# EAGLE design Xadow - GSM Breakout v1.0 (EAGLE 6.4)
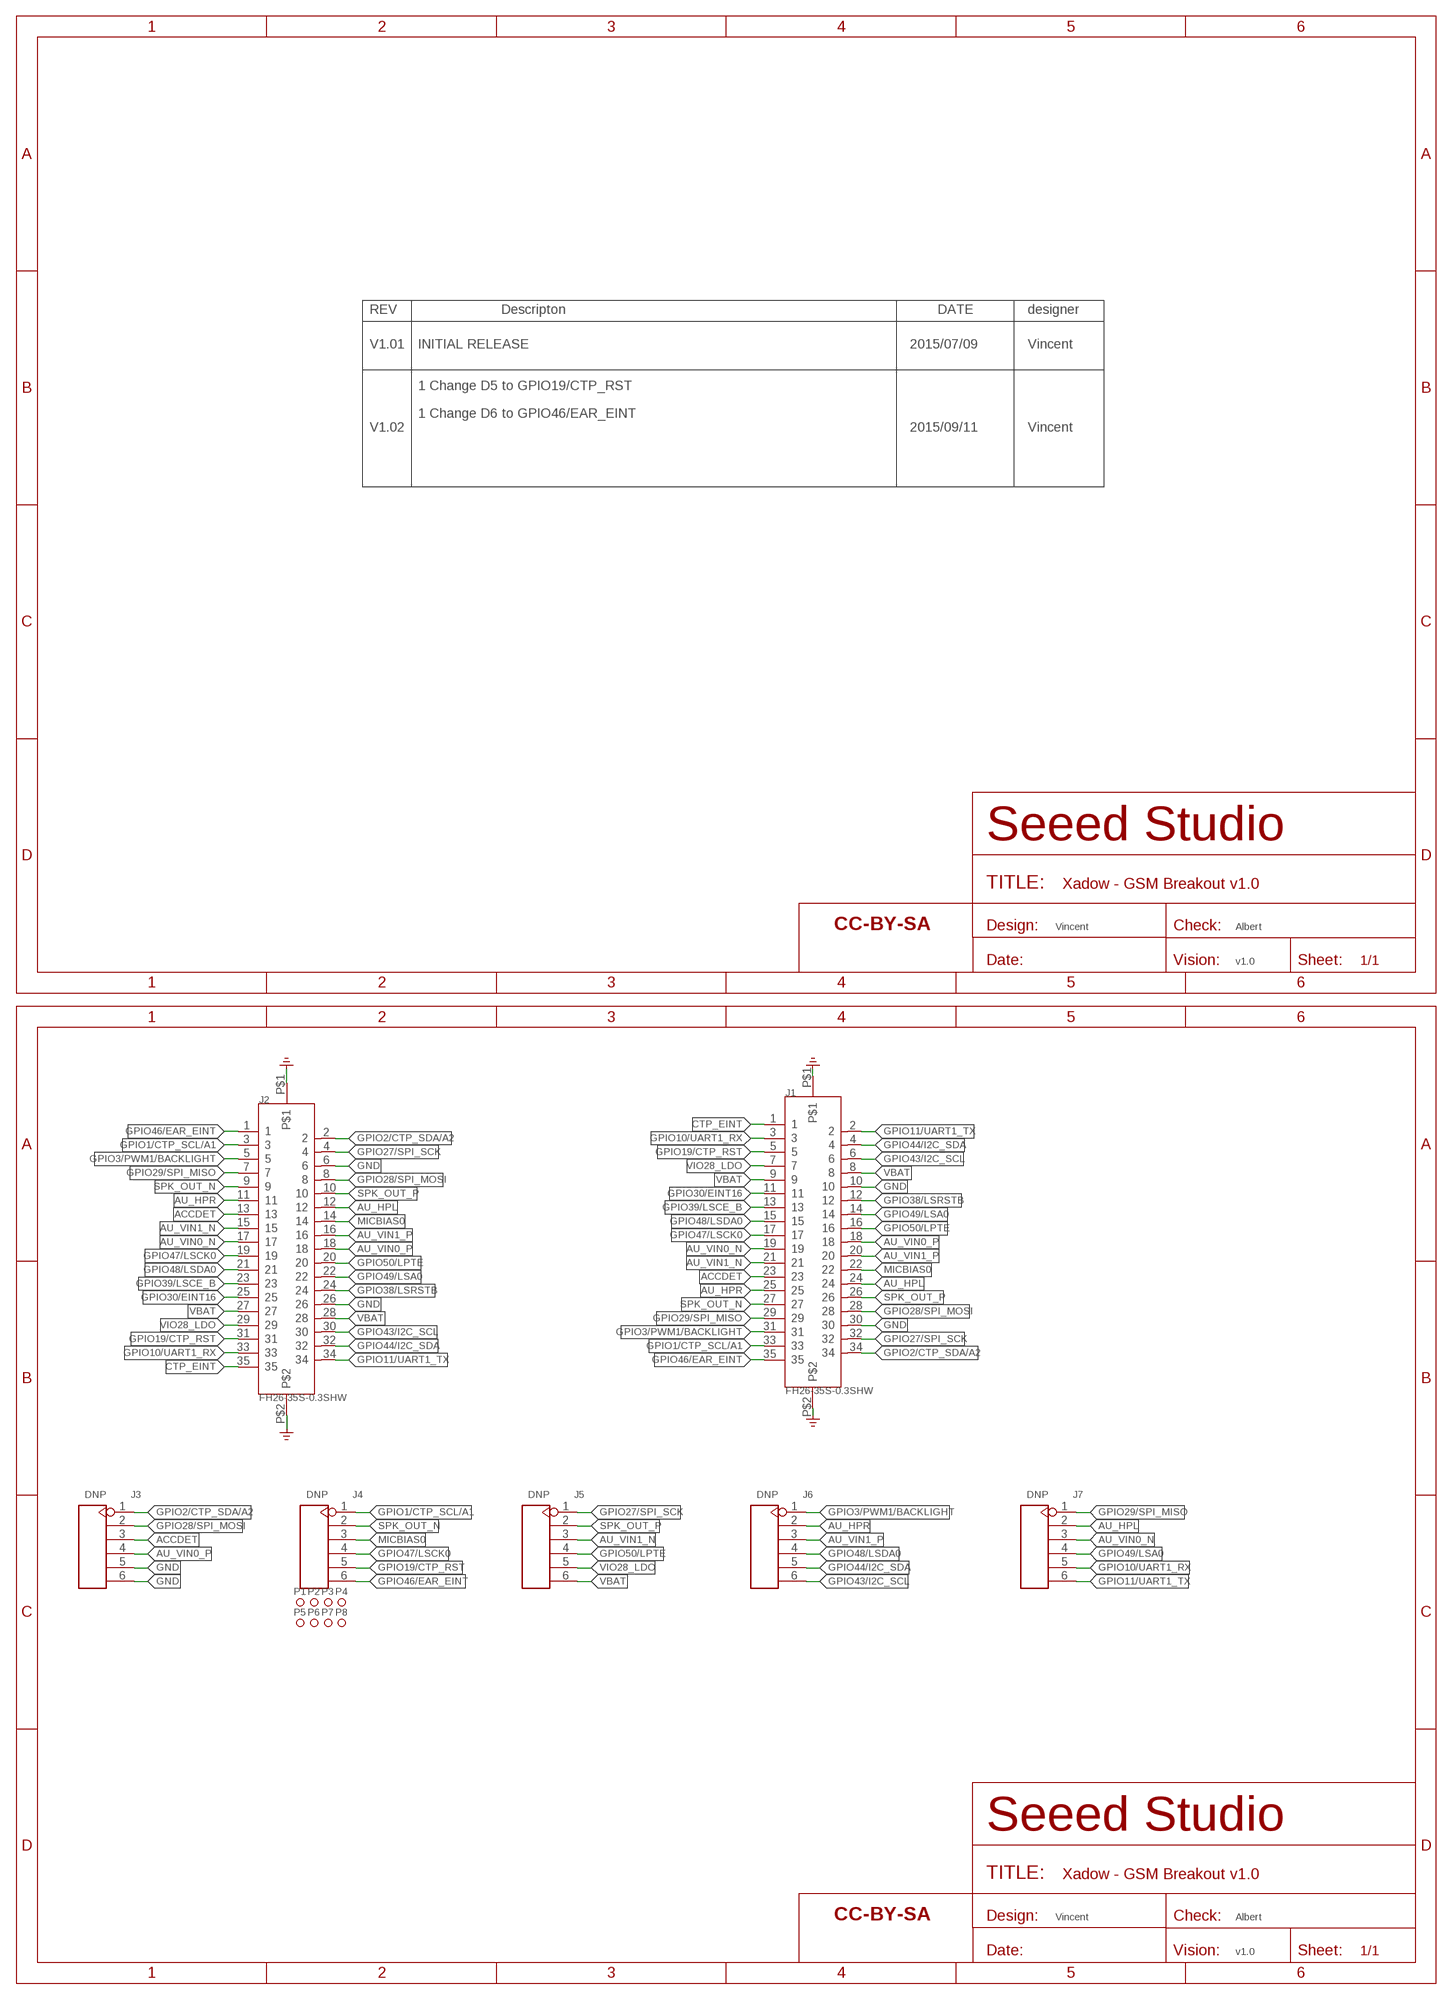
[diagram p0: schematic, sheet 1]

## Parts
FR1  SEEEDSTUDIO-OPEN-SCH-FRAME  [SEEEDSTUDIO-PCB-FRAME]
FR2  SEEEDSTUDIO-OPEN-SCH-FRAME  [SEEEDSTUDIO-PCB-FRAME]
J1  FH26-35S-0.3SHW  FPC-CONNECTER-35P(FH26W-35S-0.3SHW(10))  [FPC35-SMD-0.3(FH26W)]
J2  FH26-35S-0.3SHW  FPC-CONNECTER-35P(FH26W-35S-0.3SHW(10))  [FPC35-SMD-0.3(FH26W)]
J3  DNP  HEADER-6P-65/35MIL  [H6-2.54-C65D35MIL]
J4  DNP  HEADER-6P-65/35MIL  [H6-2.54-C65D35MIL]
J5  DNP  HEADER-6P-65/35MIL  [H6-2.54-C65D35MIL]
J6  DNP  HEADER-6P-65/35MIL  [H6-2.54-C65D35MIL]
J7  DNP  HEADER-6P-65/35MIL  [H6-2.54-C65D35MIL]
P1  MARK-1.0'ANNULAR'  [ROUND-MARK-1.0]
P2  MARK-1.0'ANNULAR'  [ROUND-MARK-1.0]
P3  MARK-1.0'ANNULAR'  [ROUND-MARK-1.0]
P4  MARK-1.0'ANNULAR'  [ROUND-MARK-1.0]
P5  MARK-1.0'ANNULAR'  [ROUND-MARK-1.0]
P6  MARK-1.0'ANNULAR'  [ROUND-MARK-1.0]
P7  MARK-1.0'ANNULAR'  [ROUND-MARK-1.0]
P8  MARK-1.0'ANNULAR'  [ROUND-MARK-1.0]

## Nets
ACCDET: J1.23 J2.13 J3.3
AU_HPL: J1.24 J2.12 J7.2
AU_HPR: J1.25 J2.11 J6.2
AU_VIN0_N: J1.19 J2.17 J7.3
AU_VIN0_P: J1.18 J2.18 J3.4
AU_VIN1_N: J1.21 J2.15 J5.3
AU_VIN1_P: J1.20 J2.16 J6.3
CTP_EINT: J1.1 J2.35
GND: J1.10 J1.30 J1.P$1 J1.P$2 J2.6 J2.26 J2.P$1 J2.P$2 J3.5 J3.6 ; supply symbol labelled GND_POWER
GPIO1/CTP_SCL/A1: J1.33 J2.3 J4.1
GPIO2/CTP_SDA/A2: J1.34 J2.2 J3.1
GPIO3/PWM1/BACKLIGHT: J1.31 J2.5 J6.1
GPIO10/UART1_RX: J1.3 J2.33 J7.5
GPIO11/UART1_TX: J1.2 J2.34 J7.6
GPIO19/CTP_RST: J1.5 J2.31 J4.5
GPIO27/SPI_SCK: J1.32 J2.4 J5.1
GPIO28/SPI_MOSI: J1.28 J2.8 J3.2
GPIO29/SPI_MISO: J1.29 J2.7 J7.1
GPIO30/EINT16: J1.11 J2.25
GPIO38/LSRSTB: J1.12 J2.24
GPIO39/LSCE_B: J1.13 J2.23
GPIO43/I2C_SCL: J1.6 J2.30 J6.6
GPIO44/I2C_SDA: J1.4 J2.32 J6.5
GPIO46/EAR_EINT: J1.35 J2.1 J4.6
GPIO47/LSCK0: J1.17 J2.19 J4.4
GPIO48/LSDA0: J1.15 J2.21 J6.4
GPIO49/LSA0: J1.14 J2.22 J7.4
GPIO50/LPTE: J1.16 J2.20 J5.4
MICBIAS0: J1.22 J2.14 J4.3
SPK_OUT_N: J1.27 J2.9 J4.2
SPK_OUT_P: J1.26 J2.10 J5.2
VBAT: J1.8 J1.9 J2.27 J2.28 J5.6
VIO28_LDO: J1.7 J2.29 J5.5

## Notes on the sheet
- REV | Descripton | DATE | designer
- V1.01 | INITIAL RELEASE | 2015/07/09 | Vincent
- 1 Change D5 to GPIO19/CTP_RST
- 1 Change D6 to GPIO46/EAR_EINT
- V1.02 | 2015/09/11 | Vincent
- Vincent | Albert
- v1.0
- Vincent | Albert
- v1.0

## Library data of the parts
FR1 FR2 = moudle-new:SEEEDSTUDIO-OPEN-SCH-FRAME
J1 J2 = template:FPC-CONNECTER-35P(FH26W-35S-0.3SHW(10))
J3-J7 = Connector-new:HEADER-6P
P1-P8 = Discrete-new:MARK-1.0; PARTNO: DNP

## Board
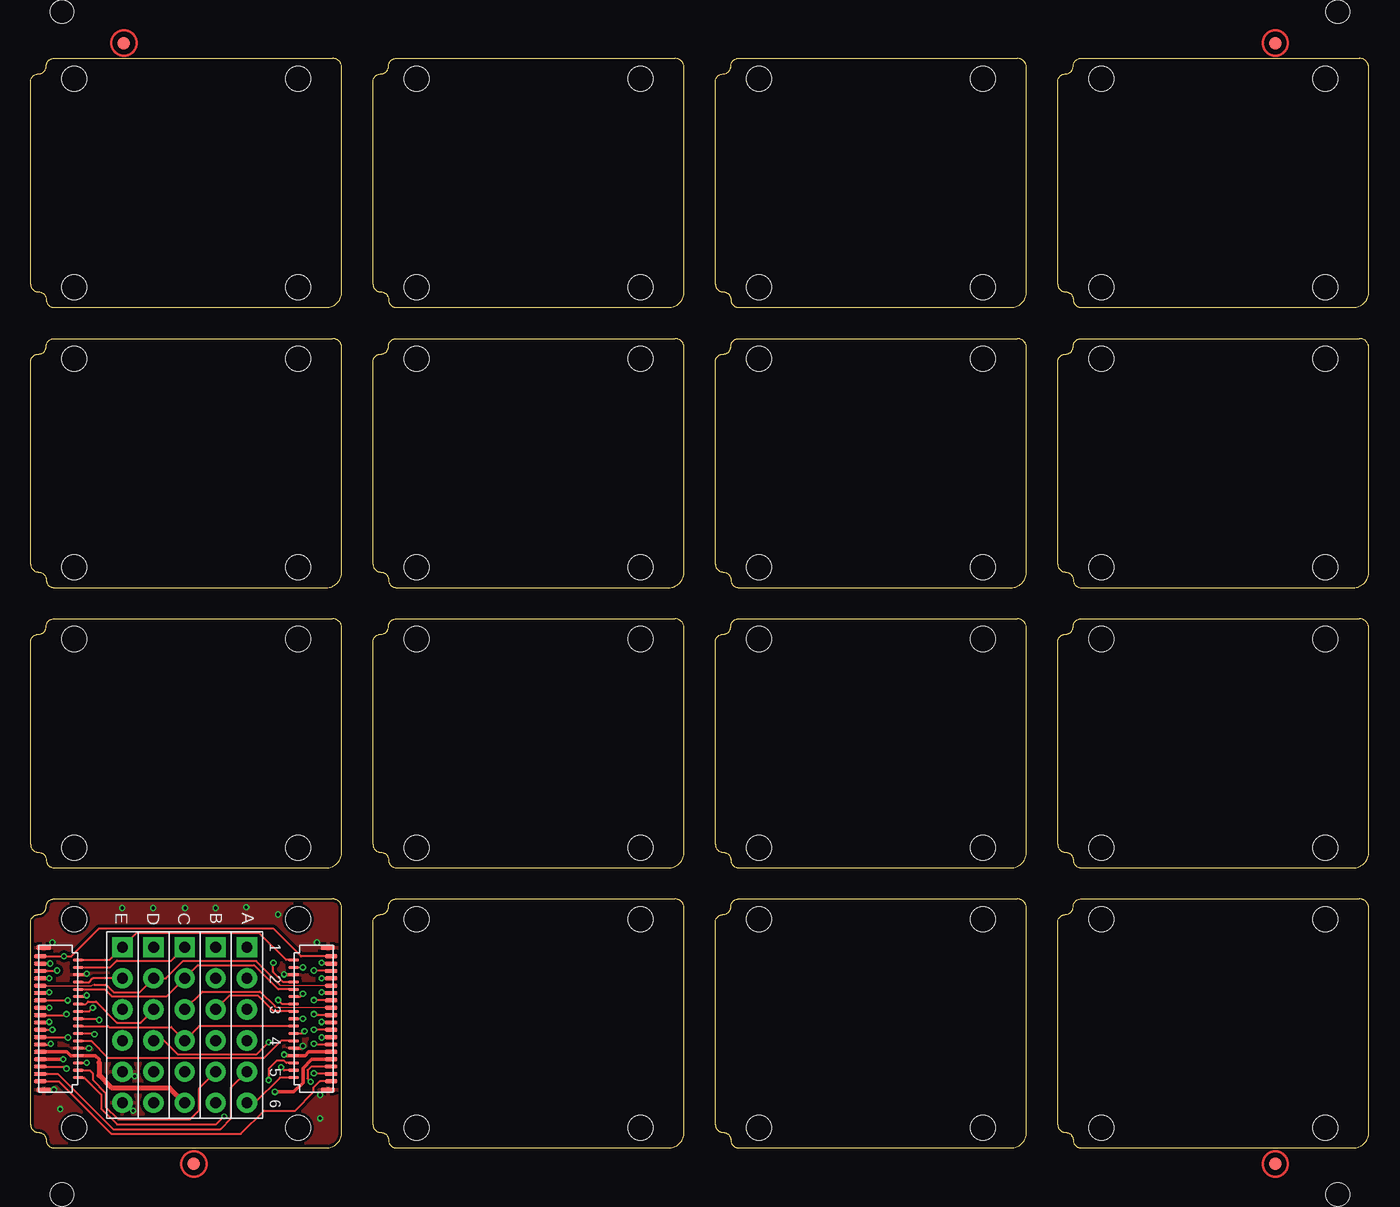
[diagram p1: board, top side]
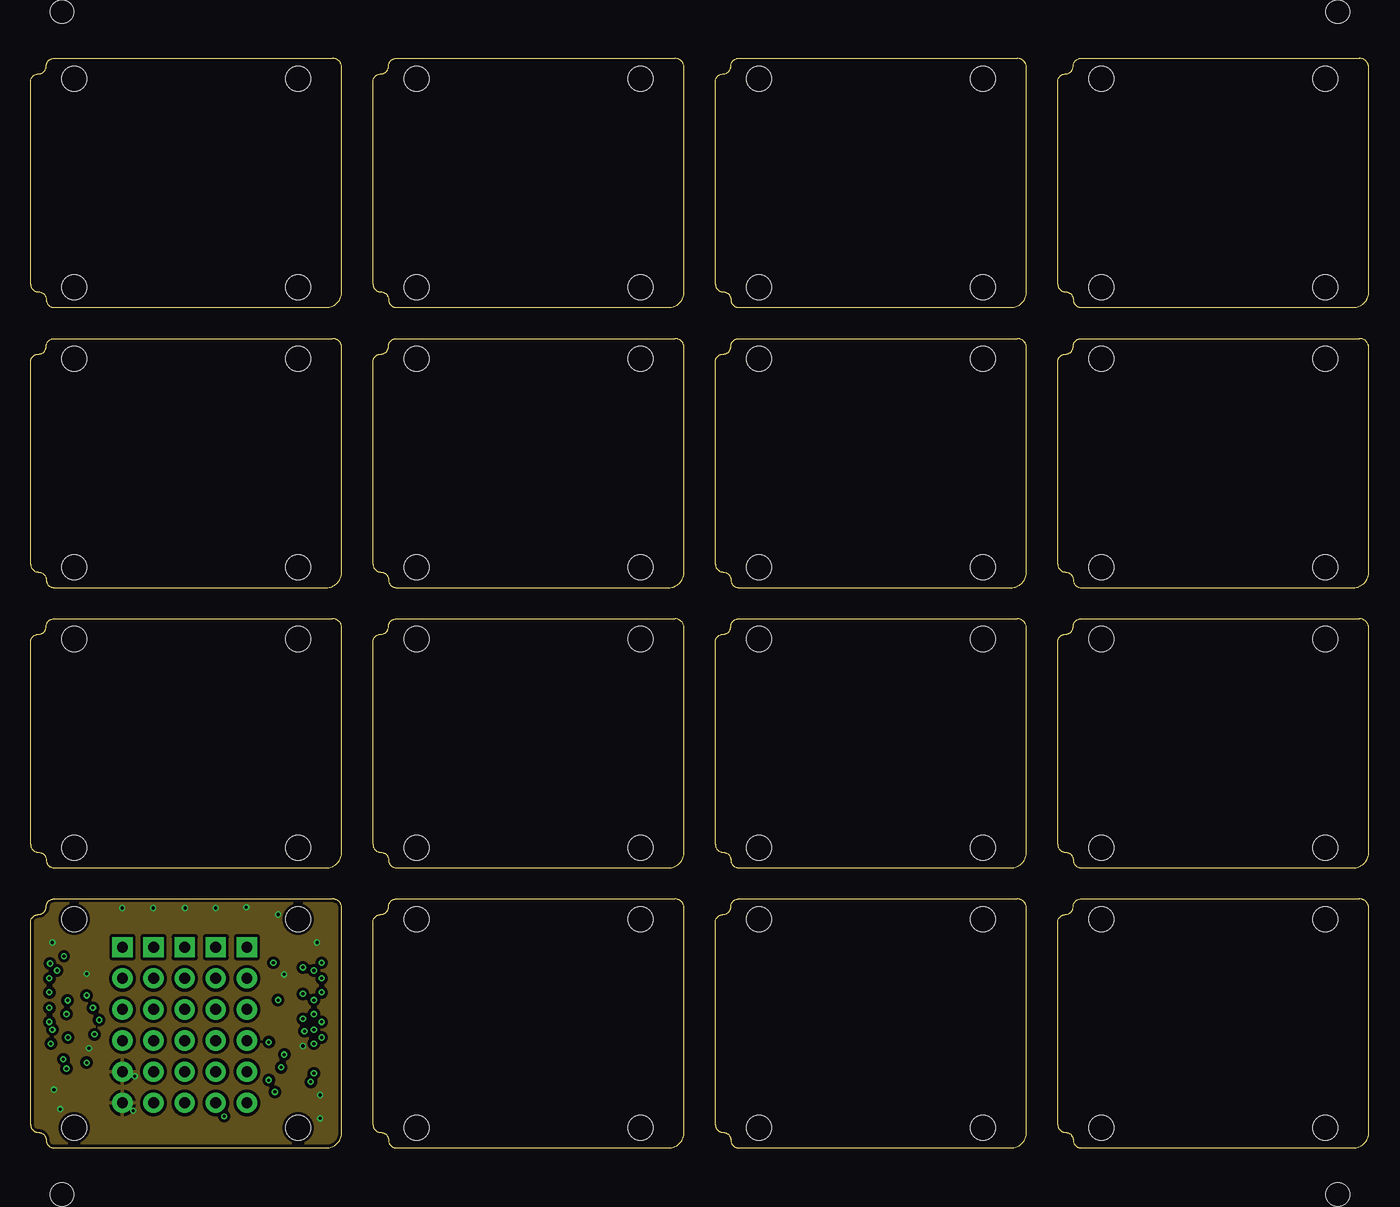
[diagram p2: board, inner layer Route2]
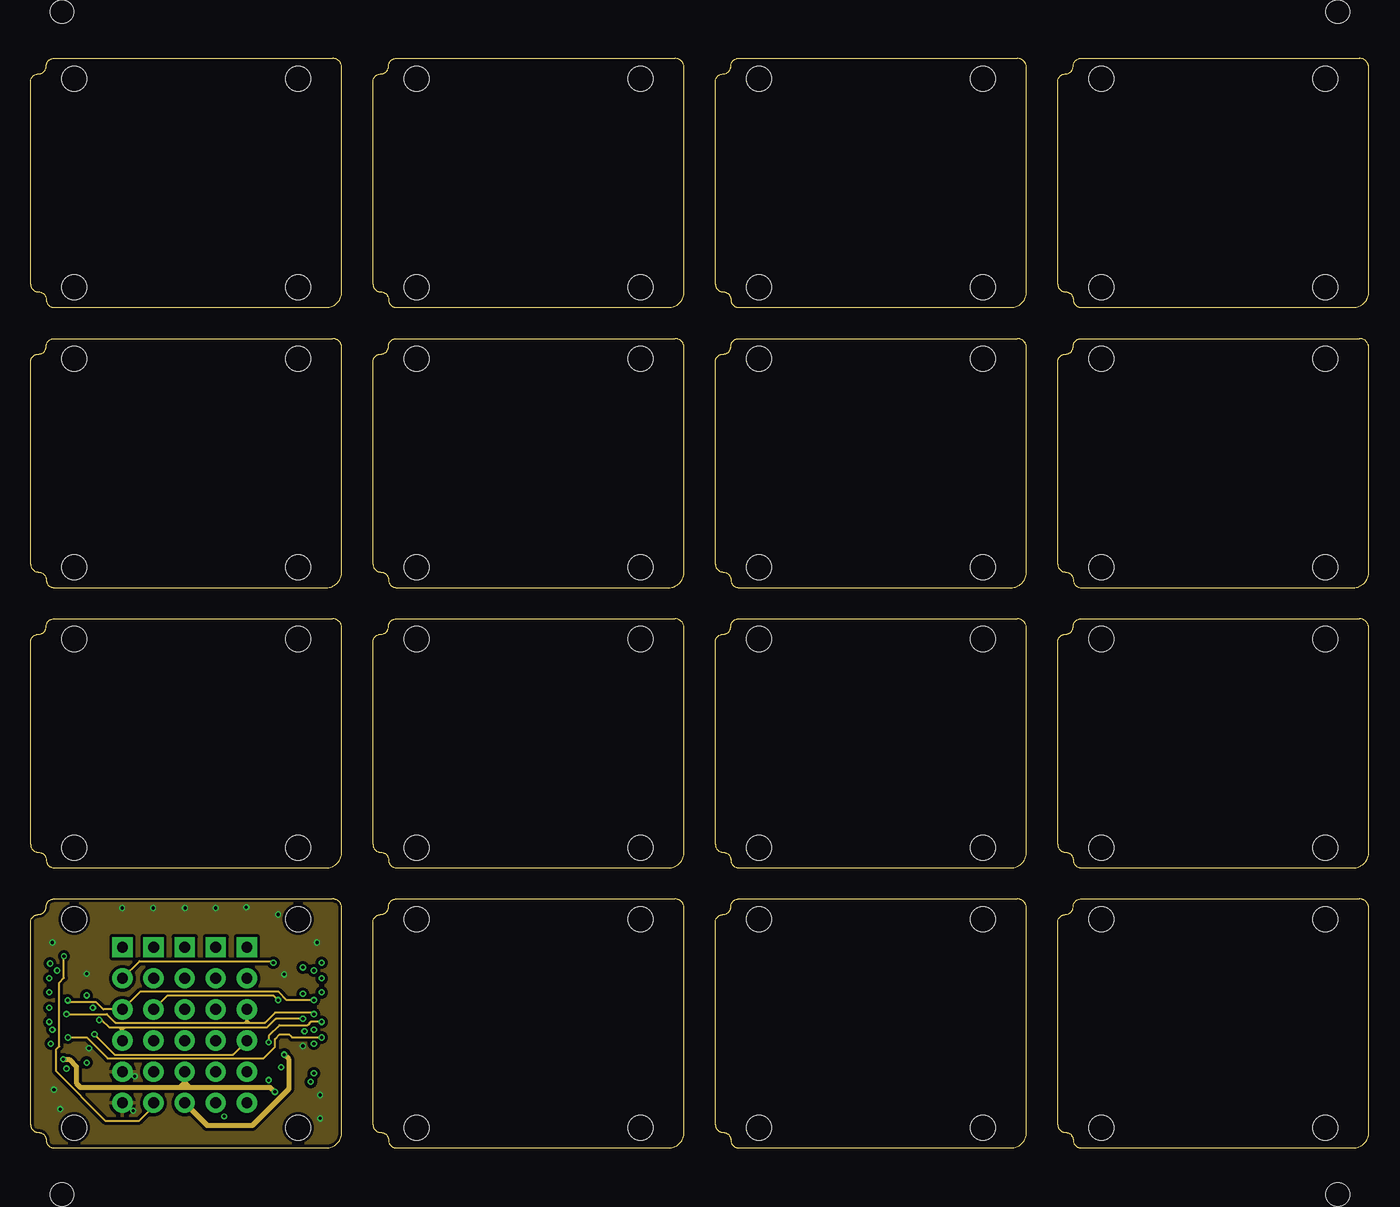
[diagram p3: board, inner layer Route15]
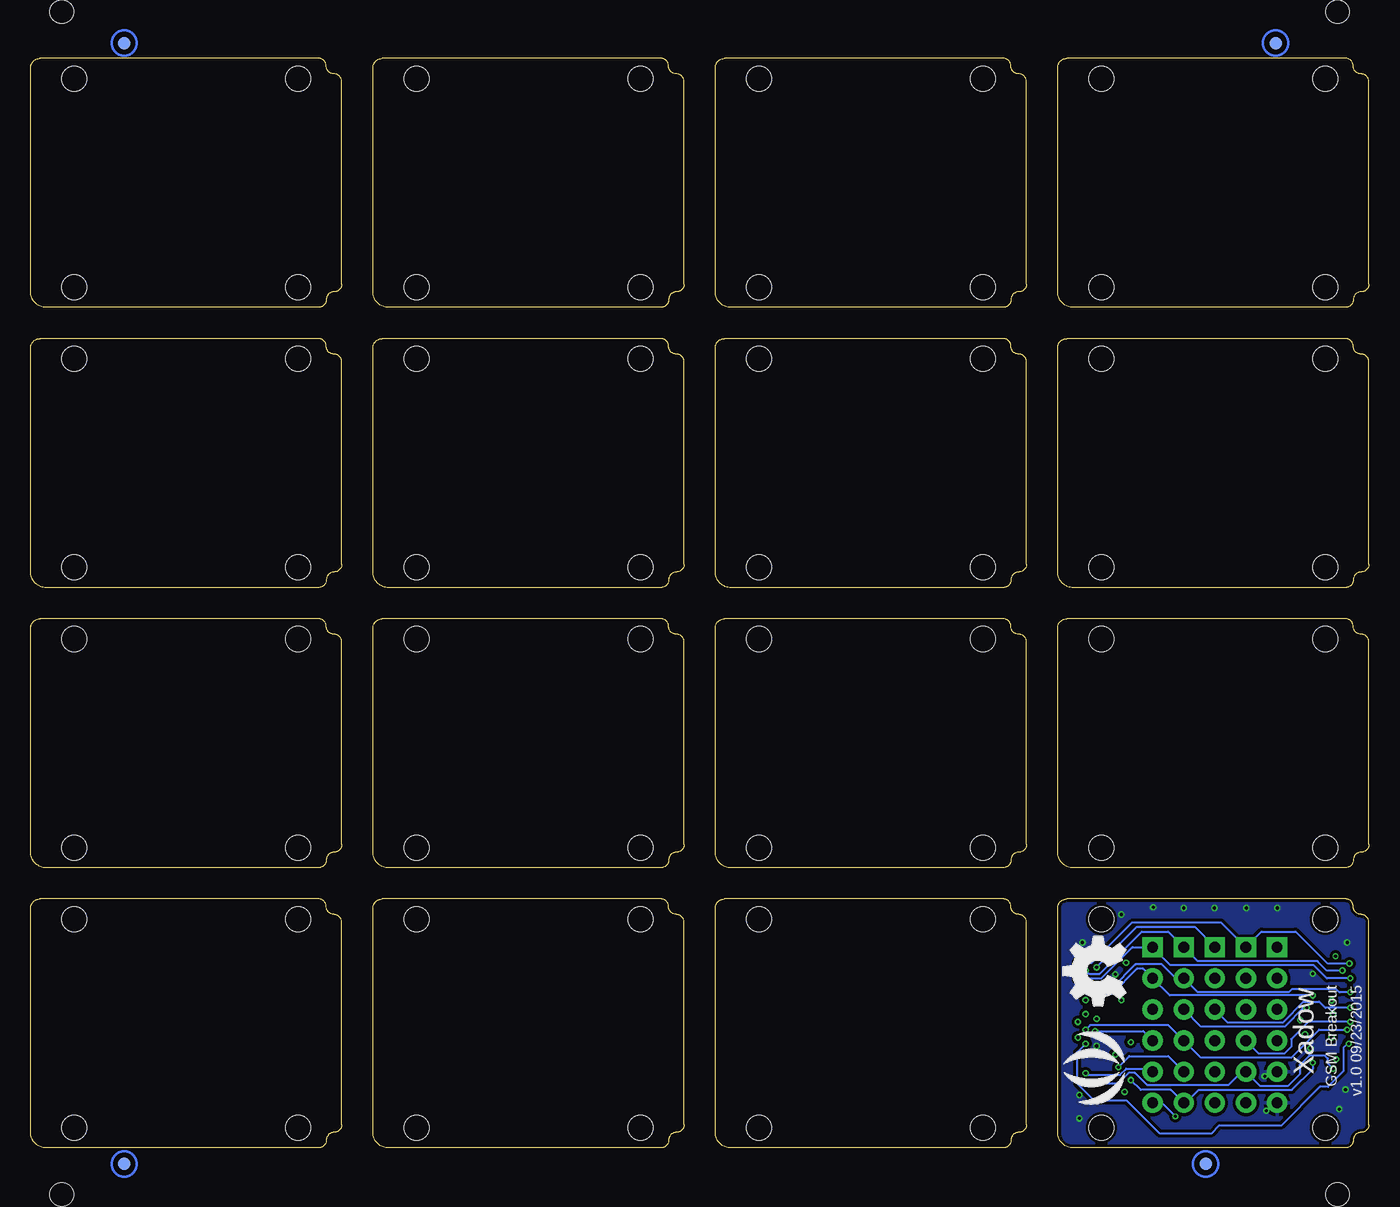
[diagram p4: board, bottom side, seen from below]

Size 109.22 x 88.9 mm. Coordinates in mm from the lower left corner, seen from the top.
Outline: 25.4,19.56 25.4,1.27 arc-90 24.13,0 1.91,0 arc-90 1.27,0.63 arc90 0.64,1.27 arc-90 0,1.9 0,18.41 arc-90 0.64,19.05 arc90 1.27,19.68 arc-90 1.91,20.32 24.64,20.32
Outline: 25.4,19.56 arc90 24.64,20.32
Outline: 25.4,19.56 arc90 24.64,20.32
Outline: 53.34,19.56 53.34,1.27 arc-90 52.07,0 29.85,0 arc-90 29.21,0.63 arc90 28.58,1.27 arc-90 27.94,1.9 27.94,18.41 arc-90 28.58,19.05 arc90 29.21,19.68 arc-90 29.85,20.32 52.58,20.32
Outline: 53.34,19.56 arc90 52.58,20.32
Outline: 53.34,19.56 arc90 52.58,20.32
Outline: 81.28,19.56 81.28,1.27 arc-90 80.01,0 57.79,0 arc-90 57.15,0.63 arc90 56.52,1.27 arc-90 55.88,1.9 55.88,18.41 arc-90 56.52,19.05 arc90 57.15,19.68 arc-90 57.79,20.32 80.52,20.32
Outline: 81.28,19.56 arc90 80.52,20.32
Outline: 81.28,19.56 arc90 80.52,20.32
Outline: 109.22,19.56 109.22,1.27 arc-90 107.95,0 85.73,0 arc-90 85.09,0.63 arc90 84.46,1.27 arc-90 83.82,1.9 83.82,18.41 arc-90 84.46,19.05 arc90 85.09,19.68 arc-90 85.73,20.32 108.46,20.32
Outline: 109.22,19.56 arc90 108.46,20.32
Outline: 109.22,19.56 arc90 108.46,20.32
Outline: 25.4,42.42 25.4,24.13 arc-90 24.13,22.86 1.91,22.86 arc-90 1.27,23.49 arc90 0.64,24.13 arc-90 0,24.76 0,41.27 arc-90 0.64,41.91 arc90 1.27,42.54 arc-90 1.91,43.18 24.64,43.18
Outline: 25.4,42.42 arc90 24.64,43.18
Outline: 25.4,42.42 arc90 24.64,43.18
Outline: 53.34,42.42 53.34,24.13 arc-90 52.07,22.86 29.85,22.86 arc-90 29.21,23.49 arc90 28.58,24.13 arc-90 27.94,24.76 27.94,41.27 arc-90 28.58,41.91 arc90 29.21,42.54 arc-90 29.85,43.18 52.58,43.18
Outline: 53.34,42.42 arc90 52.58,43.18
Outline: 53.34,42.42 arc90 52.58,43.18
Outline: 81.28,42.42 81.28,24.13 arc-90 80.01,22.86 57.79,22.86 arc-90 57.15,23.49 arc90 56.52,24.13 arc-90 55.88,24.76 55.88,41.27 arc-90 56.52,41.91 arc90 57.15,42.54 arc-90 57.79,43.18 80.52,43.18
Outline: 81.28,42.42 arc90 80.52,43.18
Outline: 81.28,42.42 arc90 80.52,43.18
Outline: 109.22,42.42 109.22,24.13 arc-90 107.95,22.86 85.73,22.86 arc-90 85.09,23.49 arc90 84.46,24.13 arc-90 83.82,24.76 83.82,41.27 arc-90 84.46,41.91 arc90 85.09,42.54 arc-90 85.73,43.18 108.46,43.18
Outline: 109.22,42.42 arc90 108.46,43.18
Outline: 109.22,42.42 arc90 108.46,43.18
Outline: 25.4,65.28 25.4,46.99 arc-90 24.13,45.72 1.91,45.72 arc-90 1.27,46.35 arc90 0.64,46.99 arc-90 0,47.62 0,64.13 arc-90 0.64,64.77 arc90 1.27,65.4 arc-90 1.91,66.04 24.64,66.04
Outline: 25.4,65.28 arc90 24.64,66.04
Outline: 25.4,65.28 arc90 24.64,66.04
Outline: 53.34,65.28 53.34,46.99 arc-90 52.07,45.72 29.85,45.72 arc-90 29.21,46.35 arc90 28.58,46.99 arc-90 27.94,47.62 27.94,64.13 arc-90 28.58,64.77 arc90 29.21,65.4 arc-90 29.85,66.04 52.58,66.04
Outline: 53.34,65.28 arc90 52.58,66.04
Outline: 53.34,65.28 arc90 52.58,66.04
Outline: 81.28,65.28 81.28,46.99 arc-90 80.01,45.72 57.79,45.72 arc-90 57.15,46.35 arc90 56.52,46.99 arc-90 55.88,47.62 55.88,64.13 arc-90 56.52,64.77 arc90 57.15,65.4 arc-90 57.79,66.04 80.52,66.04
Outline: 81.28,65.28 arc90 80.52,66.04
Outline: 81.28,65.28 arc90 80.52,66.04
Outline: 109.22,65.28 109.22,46.99 arc-90 107.95,45.72 85.73,45.72 arc-90 85.09,46.35 arc90 84.46,46.99 arc-90 83.82,47.62 83.82,64.13 arc-90 84.46,64.77 arc90 85.09,65.4 arc-90 85.73,66.04 108.46,66.04
Outline: 109.22,65.28 arc90 108.46,66.04
Outline: 109.22,65.28 arc90 108.46,66.04
Outline: 25.4,88.14 25.4,69.85 arc-90 24.13,68.58 1.91,68.58 arc-90 1.27,69.21 arc90 0.64,69.85 arc-90 0,70.48 0,86.99 arc-90 0.64,87.63 arc90 1.27,88.26 arc-90 1.91,88.9 24.64,88.9
Outline: 25.4,88.14 arc90 24.64,88.9
Outline: 25.4,88.14 arc90 24.64,88.9
Outline: 53.34,88.14 53.34,69.85 arc-90 52.07,68.58 29.85,68.58 arc-90 29.21,69.21 arc90 28.58,69.85 arc-90 27.94,70.48 27.94,86.99 arc-90 28.58,87.63 arc90 29.21,88.26 arc-90 29.85,88.9 52.58,88.9
Outline: 53.34,88.14 arc90 52.58,88.9
Outline: 53.34,88.14 arc90 52.58,88.9
Outline: 81.28,88.14 81.28,69.85 arc-90 80.01,68.58 57.79,68.58 arc-90 57.15,69.21 arc90 56.52,69.85 arc-90 55.88,70.48 55.88,86.99 arc-90 56.52,87.63 arc90 57.15,88.26 arc-90 57.79,88.9 80.52,88.9
Outline: 81.28,88.14 arc90 80.52,88.9
Outline: 81.28,88.14 arc90 80.52,88.9
Outline: 109.22,88.14 109.22,69.85 arc-90 107.95,68.58 85.73,68.58 arc-90 85.09,69.21 arc90 84.46,69.85 arc-90 83.82,70.48 83.82,86.99 arc-90 84.46,87.63 arc90 85.09,88.26 arc-90 85.73,88.9 108.46,88.9
Outline: 109.22,88.14 arc90 108.46,88.9
Outline: 109.22,88.14 arc90 108.46,88.9
Outline: 1.27,0.63 arc90 1.91,0 24.13,0 arc90 25.4,1.27 25.4,19.56 arc90 24.64,20.32 1.91,20.32 arc90 1.27,19.68 arc-90 0.64,19.05 arc90 0,18.41 0,1.9 arc90 0.64,1.27 arc-90 1.27,0.63
Outline: 29.21,0.63 arc90 29.85,0 52.07,0 arc90 53.34,1.27 53.34,19.56 arc90 52.58,20.32 29.85,20.32 arc90 29.21,19.68 arc-90 28.58,19.05 arc90 27.94,18.41 27.94,1.9 arc90 28.58,1.27 arc-90 29.21,0.63
Outline: 57.15,0.63 arc90 57.79,0 80.01,0 arc90 81.28,1.27 81.28,19.56 arc90 80.52,20.32 57.79,20.32 arc90 57.15,19.68 arc-90 56.52,19.05 arc90 55.88,18.41 55.88,1.9 arc90 56.52,1.27 arc-90 57.15,0.63
Outline: 85.09,0.63 arc90 85.73,0 107.95,0 arc90 109.22,1.27 109.22,19.56 arc90 108.46,20.32 85.73,20.32 arc90 85.09,19.68 arc-90 84.46,19.05 arc90 83.82,18.41 83.82,1.9 arc90 84.46,1.27 arc-90 85.09,0.63
Outline: 1.27,23.49 arc90 1.91,22.86 24.13,22.86 arc90 25.4,24.13 25.4,42.42 arc90 24.64,43.18 1.91,43.18 arc90 1.27,42.54 arc-90 0.64,41.91 arc90 0,41.27 0,24.76 arc90 0.64,24.13 arc-90 1.27,23.49
Outline: 29.21,23.49 arc90 29.85,22.86 52.07,22.86 arc90 53.34,24.13 53.34,42.42 arc90 52.58,43.18 29.85,43.18 arc90 29.21,42.54 arc-90 28.58,41.91 arc90 27.94,41.27 27.94,24.76 arc90 28.58,24.13 arc-90 29.21,23.49
Outline: 57.15,23.49 arc90 57.79,22.86 80.01,22.86 arc90 81.28,24.13 81.28,42.42 arc90 80.52,43.18 57.79,43.18 arc90 57.15,42.54 arc-90 56.52,41.91 arc90 55.88,41.27 55.88,24.76 arc90 56.52,24.13 arc-90 57.15,23.49
Outline: 85.09,23.49 arc90 85.73,22.86 107.95,22.86 arc90 109.22,24.13 109.22,42.42 arc90 108.46,43.18 85.73,43.18 arc90 85.09,42.54 arc-90 84.46,41.91 arc90 83.82,41.27 83.82,24.76 arc90 84.46,24.13 arc-90 85.09,23.49
Outline: 1.27,46.35 arc90 1.91,45.72 24.13,45.72 arc90 25.4,46.99 25.4,65.28 arc90 24.64,66.04 1.91,66.04 arc90 1.27,65.4 arc-90 0.64,64.77 arc90 0,64.13 0,47.62 arc90 0.64,46.99 arc-90 1.27,46.35
Outline: 29.21,46.35 arc90 29.85,45.72 52.07,45.72 arc90 53.34,46.99 53.34,65.28 arc90 52.58,66.04 29.85,66.04 arc90 29.21,65.4 arc-90 28.58,64.77 arc90 27.94,64.13 27.94,47.62 arc90 28.58,46.99 arc-90 29.21,46.35
Outline: 57.15,46.35 arc90 57.79,45.72 80.01,45.72 arc90 81.28,46.99 81.28,65.28 arc90 80.52,66.04 57.79,66.04 arc90 57.15,65.4 arc-90 56.52,64.77 arc90 55.88,64.13 55.88,47.62 arc90 56.52,46.99 arc-90 57.15,46.35
Outline: 85.09,46.35 arc90 85.73,45.72 107.95,45.72 arc90 109.22,46.99 109.22,65.28 arc90 108.46,66.04 85.73,66.04 arc90 85.09,65.4 arc-90 84.46,64.77 arc90 83.82,64.13 83.82,47.62 arc90 84.46,46.99 arc-90 85.09,46.35
Outline: 1.27,69.21 arc90 1.91,68.58 24.13,68.58 arc90 25.4,69.85 25.4,88.14 arc90 24.64,88.9 1.91,88.9 arc90 1.27,88.26 arc-90 0.64,87.63 arc90 0,86.99 0,70.48 arc90 0.64,69.85 arc-90 1.27,69.21
Outline: 29.21,69.21 arc90 29.85,68.58 52.07,68.58 arc90 53.34,69.85 53.34,88.14 arc90 52.58,88.9 29.85,88.9 arc90 29.21,88.26 arc-90 28.58,87.63 arc90 27.94,86.99 27.94,70.48 arc90 28.58,69.85 arc-90 29.21,69.21
Outline: 57.15,69.21 arc90 57.79,68.58 80.01,68.58 arc90 81.28,69.85 81.28,88.14 arc90 80.52,88.9 57.79,88.9 arc90 57.15,88.26 arc-90 56.52,87.63 arc90 55.88,86.99 55.88,70.48 arc90 56.52,69.85 arc-90 57.15,69.21
Outline: 85.09,69.21 arc90 85.73,68.58 107.95,68.58 arc90 109.22,69.85 109.22,88.14 arc90 108.46,88.9 85.73,88.9 arc90 85.09,88.26 arc-90 84.46,87.63 arc90 83.82,86.99 83.82,70.48 arc90 84.46,69.85 arc-90 85.09,69.21
Copper layers (1*2*15*16): Top 0.035mm / dielectric 0.2mm / Route2 0.0175mm / dielectric 0.3mm / Route15 0.0175mm / dielectric 0.2mm / Bottom 0.035mm
Design rules "SeeedStudio_4layer_DRU_no_angle_20140221 *": minimum track width 4mil, minimum drill 10mil, track to track 6mil, track to pad 4mil, pad to pad 6mil, via to via 6mil, smd to smd 0mil, copper to edge 10mil, drill to drill 8mil, minimum pad ring 6mil, minimum via ring 4mil, stop-mask expansion 4mil, vias tented up to drill 100mil, thermal gap 10mil
Holes 2.03 mm at 21.84,18.67 3.56,1.65 3.56,18.67 21.85,1.65 49.79,1.65 49.79,18.67 31.5,18.67 31.5,1.65 21.85,24.51 21.85,41.53 3.56,41.53 3.56,24.51 49.79,24.51 49.79,41.53 31.5,41.53 31.5,24.51 77.73,1.65 77.73,18.67 59.44,18.67 59.44,1.65 105.67,1.65 105.67,18.67 87.38,18.67 87.38,1.65 77.73,24.51 77.73,41.53 59.44,41.53 59.44,24.51 105.67,24.51 105.67,41.53 87.38,41.53 87.38,24.51 21.85,47.37 21.85,64.39 3.56,64.39 3.56,47.37 49.79,47.37 49.79,64.39 31.5,64.39 31.5,47.37 21.85,70.23 21.85,87.25 3.56,87.25 3.56,70.23 49.79,70.23 49.79,87.25 31.5,87.25 31.5,70.23 77.73,47.37 77.73,64.39 59.44,64.39 59.44,47.37 105.67,47.37 105.67,64.39 87.38,64.39 87.38,47.37 77.73,70.23 77.73,87.25 59.44,87.25 59.44,70.23 105.67,70.23 105.67,87.25 87.38,87.25 87.38,70.23
Holes 1.91 mm at 2.54,-3.81 106.68,-3.81 106.68,92.71 2.54,92.71

### Footprints (pad centres in the part's own frame; a part is rotated, then mirrored left to right if it is on the bottom)
FPC35-SMD-0.3(FH26W) = smd 0.3 x 1: 1 -5.1,-1.551; 3 -4.5,-1.551; 5 -3.9,-1.551; 7 -3.3,-1.551; 9 -2.7,-1.551; 11 -2.1,-1.551; 13 -1.5,-1.551; 15 -0.9,-1.551; 17 -0.3,-1.551; 19 0.3,-1.551; 21 0.9,-1.551; 23 1.5,-1.551; 25 2.1,-1.551; 27 2.7,-1.551; 29 3.3,-1.551; 31 3.9,-1.551; 33 4.5,-1.551; 35 5.1,-1.551 | smd 0.254 x 0.851: 2 -4.8,1.524; 4 -4.2,1.524; 6 -3.6,1.524; 8 -3,1.524; 10 -2.4,1.524; 12 -1.8,1.524; 14 -1.2,1.524; 16 -0.6,1.524; 18 0,1.524; 20 0.6,1.524; 22 1.2,1.524; 24 1.8,1.524; 26 2.4,1.524; 28 3,1.524; 30 3.6,1.524; 32 4.2,1.524; 34 4.8,1.524 | smd 0.4 x 1.15: P$1 5.8,-1.276; P$2 -5.8,-1.276
H6-2.54-C65D35MIL = drill 0.889 pad 1.651 square: 1 0,6.35 | drill 0.889 pad 1.651: 2 0,3.81; 3 0,1.27; 4 0,-1.27; 5 0,-3.81; 6 0,-6.35
ROUND-MARK-1.0 = smd 1.016 x 1.016: P$1 0,0

### Placement (x,y rotation side)
FR1  -1.6,-14.19 0 top  (outside the outline)
FR2  -6.11,-20.73 0 top  (outside the outline)
J1  22.99,10.54 90 top
J2  2.35,10.54 270 top
J3  7.49,10.03 0 top
J4  10.03,10.03 0 top
J5  12.57,10.03 0 top
J6  15.11,10.03 0 top
J7  17.65,10.03 0 top
P1  13.32,-1.3 0 top
P2  13.32,-1.3 0 bottom
P3  7.61,90.14 90 top
P4  7.61,90.14 270 bottom
P5  101.59,90.14 90 top
P6  101.59,90.14 270 bottom
P7  101.59,-1.3 90 top
P8  101.59,-1.3 270 bottom
U$18  [OSHW_FILLX200_NOTEXT]  19.86,11.6 90 bottom
U$20  [SEEED-SILK-280*268MIL]  21.64,6.52 90 bottom

### Tracks (layer width: path | path; a pad name or v marks a point on that pad's centre or on a via)
ACCDET  (via drill 0.25 pad 0.51)
  Top 0.152: J2.13 v3.02,12.04 | J1.23 23.14,12.04 v23.11,12.06
  Route15 0.152: v23.11,12.06 20.9,12.06 20.19,12.78 8.99,12.78 7.52,11.3 J3.3 5.94,11.3 5.36,11.89 3.18,11.89 v3.02,12.04
AU_HPL  (via drill 0.25 pad 0.51)
  Top 0.152: J2.12 4.47,12.34 v4.57,12.45 | J1.24 21.99,12.34 v22.23,12.57
  Bottom 0.152: v4.57,12.45 16.26,12.45 J7.2 18.42,14.6 18.92,14.6 20.96,12.57 v22.23,12.57
AU_HPR  (via drill 0.25 pad 0.51)
  Top 0.152: J2.11 1.47,12.64 v1.52,12.7 | J1.25 23.81,12.64 v23.75,12.7
  Bottom 0.152: v1.52,12.7 2.41,12.7 2.67,12.95 6.27,12.95 6.48,12.75 14.02,12.75 J6.2 15.75,13.84 16.89,14.99 19.05,14.99 20.96,13.08 23.37,13.08 v23.75,12.7
AU_VIN0_N  (via drill 0.25 pad 0.51)
  Top 0.152: J1.19 23.2,10.84 v23.11,10.92 | J2.17 2.84,10.84 v2.92,10.92
  Route15 0.152: v2.92,10.92 6.22,10.92 6.91,10.24 17.45,10.24 | v23.11,10.92 22.99,11.05 19.94,11.05 19.13,10.24 17.86,10.24 | J7.3 17.65,10.41 | 17.65,10.41 17.65,10.24 | 17.45,10.24 17.65,10.24 | 17.65,10.24 17.86,10.24 | 17.65,10.41 17.63,10.41 17.45,10.24 | 17.65,10.41 17.68,10.41 17.86,10.24
AU_VIN0_P  (via drill 0.25 pad 0.51)
  Top 0.152: J2.18 5.49,10.54 v5.59,10.44 | J1.18 v22.23,10.54
  Route15 0.102: 7.7,9.8 7.7,9.83
  Route15 0.152: v5.59,10.44 5.82,10.44 6.43,9.83 7.24,9.83 | 7.24,9.83 7.49,9.83 | 7.49,9.83 7.7,9.83 19.3,9.83 20.02,10.54 v22.23,10.54 | J3.4 7.49,9.58 | 7.49,9.6 7.49,9.83 | 7.49,9.58 7.24,9.83 | 7.49,9.58 7.49,9.6 | 7.49,9.6 7.7,9.8
AU_VIN1_N  (via drill 0.25 pad 0.51)
  Top 0.102: J1.21 20.06,11.44 19.94,11.56
  Top 0.152: J2.15 1.51,11.44 v1.52,11.43 | J5.3 14.03,12.76 18.73,12.76 19.94,11.56
  Bottom 0.152: J5.3 11.51,10.24 7.04,10.24 5.33,11.94 4.06,11.94 3.56,11.43 v1.52,11.43
AU_VIN1_P  (via drill 0.25 pad 0.51)
  Top 0.152: J2.16 4.79,11.14 v5.08,11.43 | J6.3 16.26,12.45 18.54,12.45 19.85,11.14 J1.20
  Bottom 0.152: J6.3 13.72,9.91 6.86,9.91 5.33,11.43 v5.08,11.43
CTP_EINT
  Top 0.152: J2.35 2.31,5.44 6.59,1.16 17.16,1.16 19.05,3.05 21.59,3.05 23.11,4.57 23.11,4.95 23.6,5.44 J1.1
GND  (via drill 0.25 pad 0.51)
  Top 0.152: J2.26 4.75,8.14 v4.76,8.13
  Top 0.305: J2.6 4.49,14.14 v4.57,14.22 | J1.30 20.72,14.14 v20.7,14.16 | J1.10 22.05,8.14 v22.23,8.32
  other vias: 1.91,4.76 1.78,16.76 8.51,5.84 8.38,3.05 23.37,16.76 23.62,4.32 7.47,19.58 10.01,19.58 12.6,19.58 15.11,19.58 17.6,19.63 20.19,19.05 23.62,2.41 2.41,3.18
  pour Top (isolate 0.254, rank 6): -0.38,20.83 25.91,20.83 25.91,-0.25 -0.38,-0.25
  pour Route2 (isolate 0.254, rank 6): -0.38,20.83 25.91,20.83 25.91,-0.25 -0.38,-0.25
  pour Route15 (isolate 0.254, rank 6): -0.38,20.83 25.91,20.83 25.91,-0.25 -0.38,-0.25
  pour Bottom (isolate 0.254, rank 6): -0.38,20.83 25.91,20.83 25.91,-0.25 -0.38,-0.25
GPIO1/CTP_SCL/A1  (via drill 0.25 pad 0.51)
  Top 0.152: J2.3 1.58,15.04 v1.59,15.05 | J1.33 23.82,15.04 v23.75,15.11
  Bottom 0.152: v1.59,15.05 3.37,15.05 5.97,17.65 8.76,17.65 J4.1 12.07,18.41 19.3,18.41 22.61,15.11 v23.75,15.11
GPIO2/CTP_SDA/A2
  Top 0.152: J2.2 6.45,15.34 J3.1 8.64,17.53 18.67,17.53 20.85,15.34 J1.34
GPIO3/PWM1/BACKLIGHT  (via drill 0.25 pad 0.51)
  Top 0.152: J2.5 2.12,14.44 v2.16,14.48 | J1.31 23.15,14.44 v23.11,14.48
  Bottom 0.152: v2.16,14.48 3.43,14.48 4.19,15.24 13.97,15.24 J6.1 16.38,17.65 18.54,17.65 21.97,14.22 22.86,14.22 v23.11,14.48
GPIO10/UART1_RX  (via drill 0.25 pad 0.51)
  Top 0.152: J2.33 2.21,6.04 6.73,1.53 15.5,1.53 16.38,2.41 16.38,4.95 J7.5 | J1.3 23.17,6.04 v23.11,6.1
  Bottom 0.152: v23.11,6.1 22.99,5.97 20.32,5.97 19.81,6.48 17.91,6.48 J7.5
GPIO11/UART1_TX  (via drill 0.25)
  Top 0.152: J7.6 18.29,3.68 20.35,5.74 J1.2 | J2.34 4.38,5.74 5.77,4.36 5.77,3.21 7.06,1.92 15.14,1.92 v15.8,2.58
  Bottom 0.152: J7.6 16.9,3.68 v15.8,2.58
GPIO19/CTP_RST  (via drill 0.25 pad 0.51)
  Top 0.152: J2.31 2.76,6.64 v2.92,6.48 | J1.5 22.9,6.64 22.61,6.35 22.61,5.65 v22.86,5.4
  Bottom 0.152: v22.86,5.4 22.71,5.25 20.5,5.25 19.61,6.13 19.1,6.13 18.08,5.12 11.48,5.12 10.38,6.22 J4.5 8.85,5.04 6.6,5.04 5.64,6.01 5.64,6.77 4.88,7.53 3.59,7.53 3.35,7.29 3.35,6.9 2.93,6.48 v2.92,6.48
GPIO27/SPI_SCK  (via drill 0.25 pad 0.51)
  Top 0.152: J2.4 6.49,14.74 7.04,15.29 11.48,15.29 J5.1 | J1.32 22.22,14.74 v22.23,14.73
  Bottom 0.152: J5.1 14.22,18.03 18.92,18.03 v22.23,14.73
GPIO28/SPI_MOSI  (via drill 0.25 pad 0.51)
  Top 0.152: J3.2 5.08,13.84 4.78,13.54 J2.8 | J1.28 20.62,13.54 19.81,14.35 v19.81,15.11
  Route15 0.152: J3.2 8.89,15.24 19.69,15.24 v19.81,15.11
GPIO29/SPI_MISO  (via drill 0.25 pad 0.51)
  Top 0.152: J2.7 v1.52,13.84 | J1.29 v23.75,13.84
  Bottom 0.152: v1.52,13.84 3.43,13.84 4.51,14.92 16.19,14.92 J7.1 19.3,16.38 21.84,13.84 v23.75,13.84
GPIO30/EINT16  (via drill 0.25 pad 0.51)
  Top 0.152: J1.11 23.18,8.44 v23.11,8.51 | J2.25 1.58,8.44 v1.65,8.51
  Bottom 0.152: v23.11,8.51 23.8,7.82 23.8,5.25 22.4,3.85 19.74,3.85 17.07,1.18 12.88,1.18 12.24,1.82 7.16,1.82 3.99,4.99 3.35,4.99 2.08,6.26 2.08,8.17 1.74,8.51 v1.65,8.51
GPIO38/LSRSTB
  Top 0.152: J1.12 20.44,8.74 19.04,7.34 6.34,7.34 4.94,8.74 J2.24
GPIO39/LSCE_B  (via drill 0.25 pad 0.51)
  Top 0.152: J1.13 23.77,9.04 v23.75,9.02 | J2.23 3.02,9.04 v3.05,9.02
  Route15 0.152: v3.05,9.02 4.57,9.02 6.27,7.32 19,7.32 19.94,8.25 19.94,8.89 20.32,9.27 21.08,9.27 21.34,9.02 v23.75,9.02
GPIO43/I2C_SCL  (via drill 0.25 pad 0.51)
  Top 0.152: J2.30 4.55,6.94 v4.57,6.96 | J1.6 20.87,6.94 20.7,7.11 20.07,7.11 19.43,6.48 v19.43,5.54
  Bottom 0.152: v19.43,5.54 18.63,4.74 16.17,4.74 J6.6 14.95,3.68 13.89,4.74 6.27,4.74 4.57,6.44 v4.57,6.96
GPIO44/I2C_SDA  (via drill 0.25 pad 0.51)
  Top 0.152: J1.4 20.68,6.34 v20.45,6.58 | J2.32 4.84,6.34 5.08,6.1 5.08,5.55 6.15,4.48 6.15,3.34 7.16,2.32 13.01,2.32 13.77,3.09 13.77,4.88 J6.5
  Bottom 0.152: v20.45,6.58 20.45,6.6 19.56,7.49 16.38,7.49 J6.5
GPIO46/EAR_EINT  (via drill 0.25)
  Top 0.152: J2.1 v2.72,15.64 3.32,15.64 5.59,17.91 19.81,17.91 22.08,15.64 J1.35
  Route15 0.152: J4.6 10.03,3.42 8.81,2.2 6.15,2.2 2.08,6.26 2.08,8.04 2.34,8.29 2.34,13.5 2.72,13.88 v2.72,15.64
GPIO47/LSCK0  (via drill 0.25 pad 0.51)
  Top 0.152: J2.19 1.48,10.24 v1.52,10.29 | J1.17 23.8,10.24 v23.75,10.29 | J4.4 10.88,8.76 11.99,7.66 18.45,7.66 v19.43,8.64
  Route15 0.152: v23.75,10.29 22.86,10.29 22.61,10.03 20.32,10.03 19.43,9.14 v19.43,8.64
  Bottom 0.152: v1.52,10.29 4.95,10.29 6.35,8.89 6.35,8.25 6.91,7.7 8.97,7.7 J4.4
GPIO48/LSDA0  (via drill 0.25 pad 0.51)
  Top 0.152: J1.15 23.13,9.64 v23.11,9.65 | J2.21 1.77,9.64 v1.78,9.65
  Bottom 0.152: v23.11,9.65 22.73,10.03 16.38,10.03 J6.4 13.72,7.37 6.35,7.37 4.06,9.65 v1.78,9.65
GPIO49/LSA0  (via drill 0.25 pad 0.51)
  Top 0.152: J2.22 5.14,9.34 v5.21,9.27 | J1.14 22.17,9.34 v22.35,9.52
  Route15 0.152: v5.21,9.27 6.86,7.62 16.51,7.62 J7.4
  Bottom 0.152: v22.35,9.52 18.42,9.52 J7.4
GPIO50/LPTE
  Top 0.152: J2.20 6.32,9.94 6.4,9.86 11.48,9.86 J5.4 13.75,9.94 J1.16
MICBIAS0  (via drill 0.25 pad 0.51)
  Top 0.152: J1.22 20.52,11.74 v20.19,12.06 | J2.14 4.5,11.74 4.7,11.94 5.33,11.94 7.04,10.24 8.97,10.24 J4.3
  Route15 0.152: J4.3 11.18,12.45 19.81,12.45 v20.19,12.06
SPK_OUT_N
  Top 0.102: J2.9 4.99,13.24 5.08,13.33 5.21,13.33 | J1.27 20.41,13.24 20.32,13.33
  Top 0.152: 20.32,13.33 18.42,15.24 12.42,15.24 11.02,13.84 J4.2 8.89,12.7 6.79,12.7 6.16,13.33 5.21,13.33
SPK_OUT_P
  Top 0.152: J1.26 20.21,12.94 18.22,14.92 13.65,14.92 J5.2 11.11,12.38 6.6,12.38 6.05,12.94 J2.10
VBAT  (via drill 0.25 pad 0.51)
  Top 0.305: J2.27 2.95,7.84 3.25,7.54 J2.28 5.29,7.54 5.59,7.24 5.59,6.98 | J1.9 22.7,7.84 22.4,7.54 J1.8 20.78,7.54 v20.7,7.62
  Top 0.406: 5.59,6.98 5.59,5.93 6.59,4.93 11.33,4.93 J5.6
  Route15 0.406: J5.6 14.4,1.85 18.11,1.85 21.08,4.83 21.08,7.24 v20.7,7.62
VIO28_LDO  (via drill 0.25 pad 0.51)
  Top 0.305: J1.7 22.95,7.24 22.23,6.52 22.23,5.33 21.46,4.57 v19.94,4.57 | J2.29 v2.67,7.24
  Route15 0.406: 12.19,4.95 4.06,4.95 3.73,5.28 3.73,6.64 3.14,7.24 v2.67,7.24 | 12.19,4.95 12.57,4.95 | 12.57,4.95 12.95,4.95 | 12.95,4.95 19.56,4.95 v19.94,4.57 | J5.5 12.57,5.33 | 12.57,5.33 12.57,4.95 | 12.57,5.33 12.19,4.95 | 12.57,5.33 12.95,4.95

### Text on the board
tPlace: E | D | C | B | A | 1 | 2 | 3 | 4 | 5 | 6
bPlace: Xadow | GSM Breakout | v1.0 09/23/2015